# EAGLE design DRV8835 Breakout (EAGLE 7.5.0)
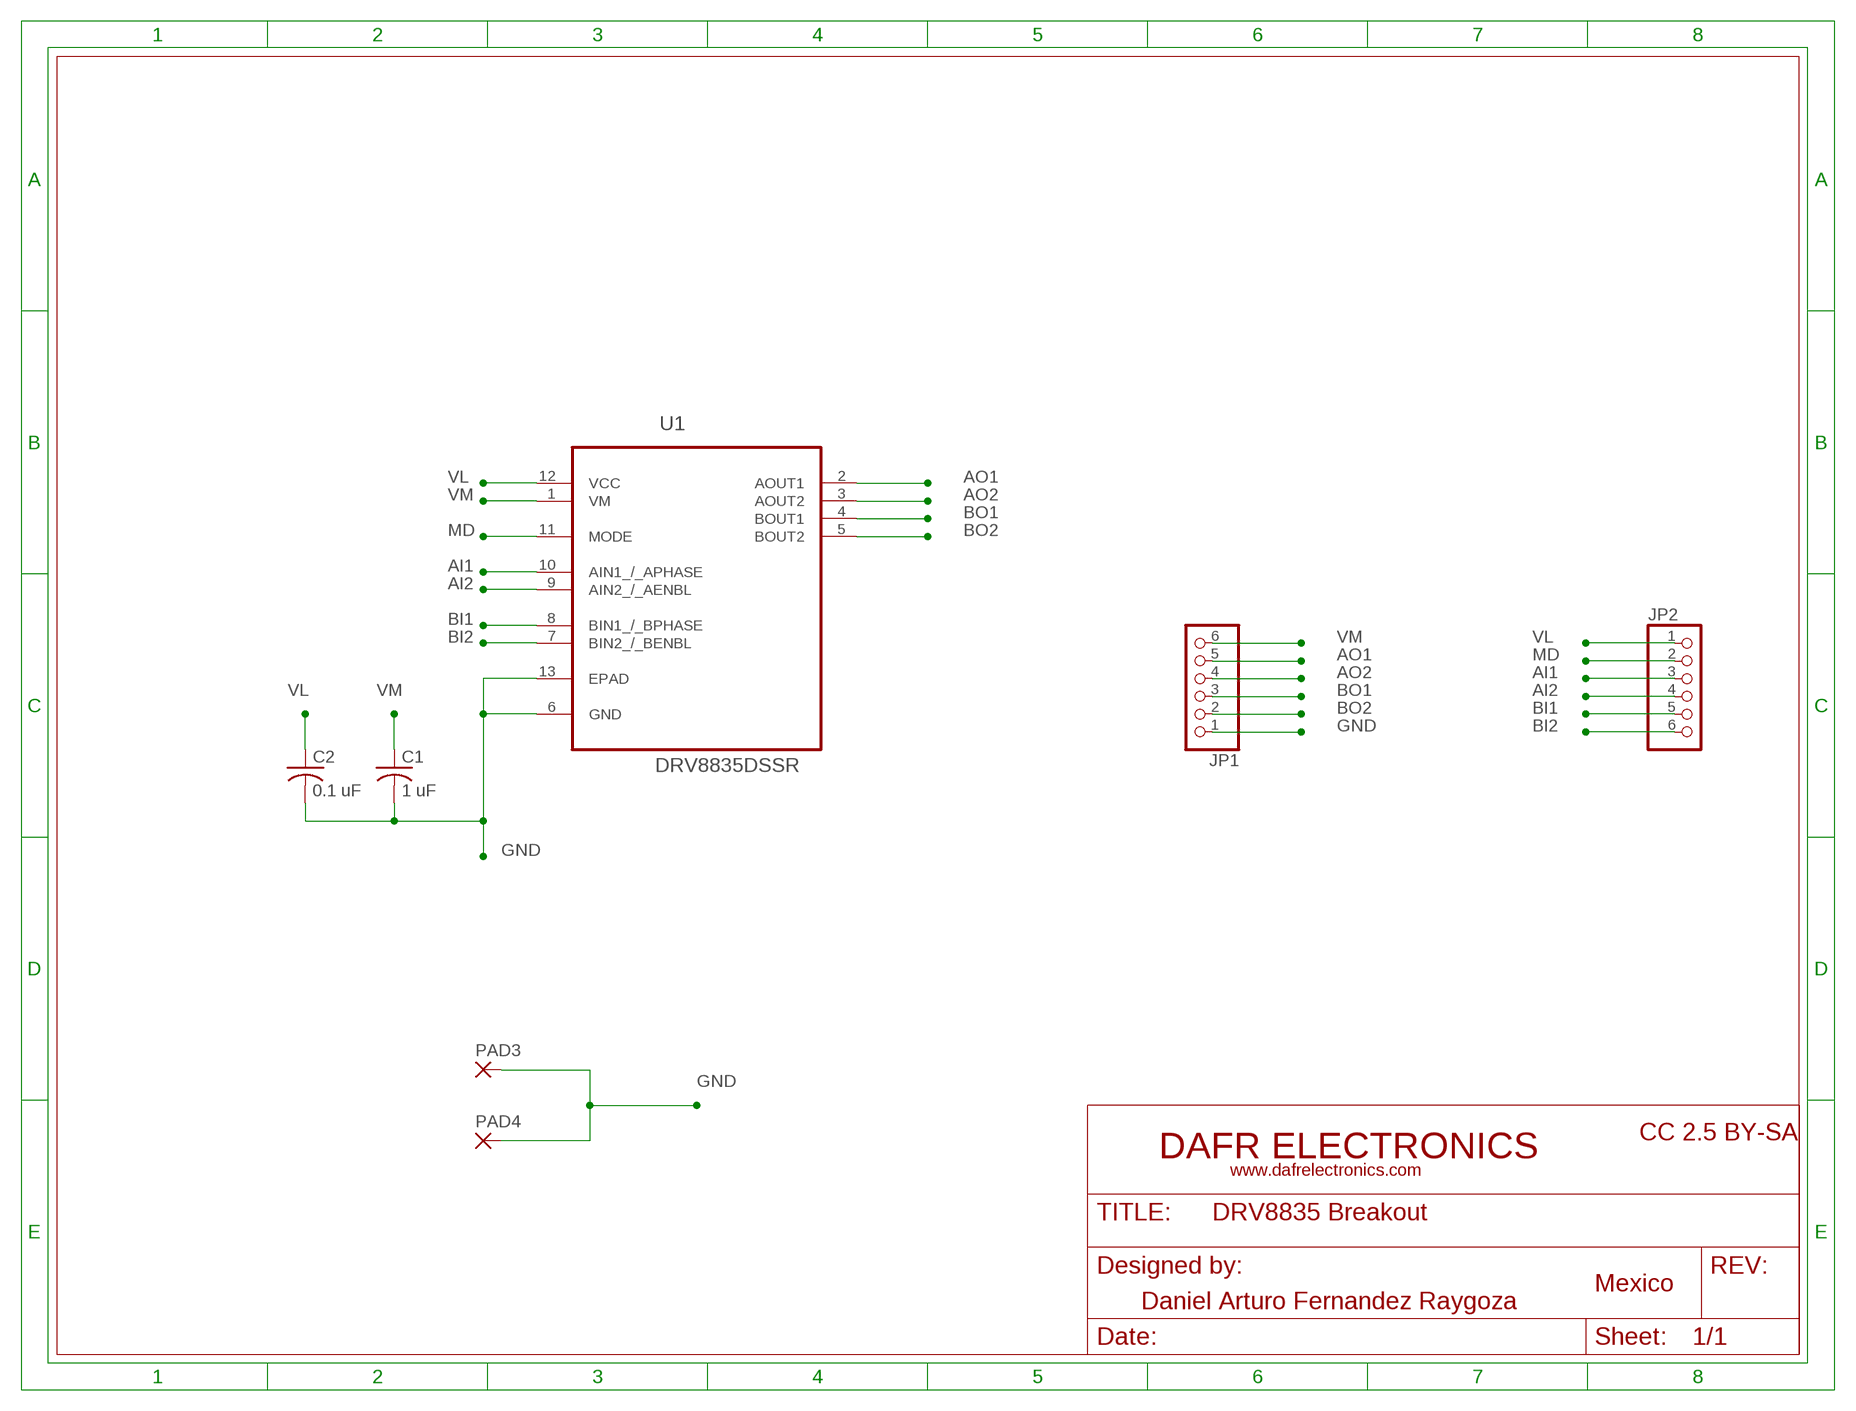
[diagram p0: schematic, sheet 1]

## Parts
C1  1 uF  C-USC0603K  [C0603K]
C2  0.1 uF  C-USC0603K  [C0603K]
JP1  PINHD-1X6CLEAN  [1X06-CLEAN]
JP2  PINHD-1X6CLEAN  [1X06-CLEAN]
PAD3  SMD2  [SMD1,27-2,54]
PAD4  SMD2  [SMD1,27-2,54]
U1  DRV8835DSSR  [SON50P200X300X80-13N]

## Nets
AI1: JP2.3 U1.10(AIN1_/_APHASE)
AI2: JP2.4 U1.9(AIN2_/_AENBL)
AO1: JP1.5 U1.2(AOUT1)
AO2: JP1.4 U1.3(AOUT2)
BI1: JP2.5 U1.8(BIN1_/_BPHASE)
BI2: JP2.6 U1.7(BIN2_/_BENBL)
BO1: JP1.3 U1.4(BOUT1)
BO2: JP1.2 U1.5(BOUT2)
GND: C1.2 C2.2 JP1.1 PAD3.1(P) PAD4.1(P) U1.6(GND) U1.13(EPAD)
MD: JP2.2 U1.11(MODE)
VL: C2.1 JP2.1 U1.12(VCC)
VM: C1.1 JP1.6 U1.1(VM)

## Library data of the parts
C1 C2 = adafruit:C-US: CAPACITOR, American symbol
JP1 JP2 = adafruit:PINHD-1X6: PIN HEADER
PAD3 PAD4 = wirepad:SMD2: SMD PAD
U1 = DRV8835:DRV8835DSSR: DUAL LOW VOLTAGE H-BRIDGE IC,SON-12; MPN: DRV8835DSSR; OC_FARNELL: 2115235; OC_NEWARK: 94T6065; PACKAGE: SON-12; SUPPLIER: TEXAS INSTRUMENTS

## Board
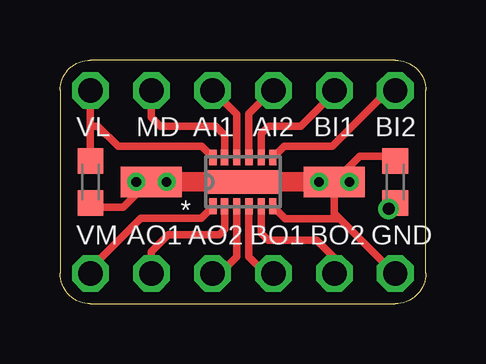
[diagram p1: board, top side]
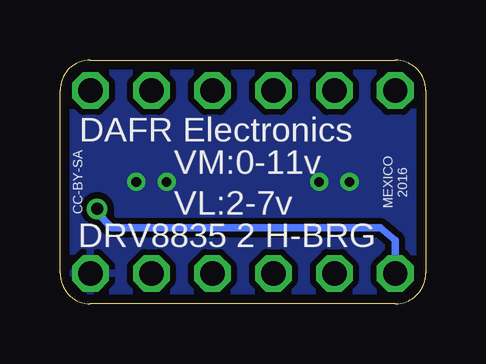
[diagram p2: board, bottom side, seen from below]

Size 15.24 x 10.16 mm. Coordinates in mm from the lower left corner, seen from the top.
Outline: 1.27,0 13.97,0 arc90 15.24,1.27 15.24,8.89 arc90 13.97,10.16 1.27,10.16 arc90 0,8.89 0,1.27 arc90 1.27,0
Copper layers (1*16): Top 0.0356mm / dielectric 1.5011mm / Bottom 0.0356mm
Design rules "oshpark-2layer *": minimum track width 6mil, minimum drill 13mil, track to track 6mil, track to pad 6mil, pad to pad 6mil, via to via 6mil, smd to smd 6mil, copper to edge 15mil, drill to drill 6mil, minimum pad ring 7mil, minimum via ring 7mil, stop-mask expansion 2.5mil, vias tented up to drill 25mil, thermal gap 10mil

### Footprints (pad centres in the part's own frame; a part is rotated, then mirrored left to right if it is on the bottom)
C0603K = smd 1.05 x 1.08: 1 -0.875,0; 2 0.875,0
1X06-CLEAN = drill 1.016 octagon: 1 -6.35,0; 2 -3.81,0; 3 -1.27,0; 4 1.27,0; 5 3.81,0; 6 6.35,0
SMD1,27-2,54 = smd 1.27 x 2.54: 1 0,0
SON50P200X300X80-13N = smd 0.66 x 0.305: 1 -1.016,1.245; 2 -1.016,0.762; 3 -1.016,0.254; 4 -1.016,-0.254; 5 -1.016,-0.762; 6 -1.016,-1.245; 7 1.016,-1.245; 8 1.016,-0.762; 9 1.016,-0.254; 10 1.016,0.254; 11 1.016,0.762; 12 1.016,1.245 | smd 0.991 x 3.099: 13 0,0

### Placement (x,y rotation side)
C1  13.97,5.08 90 top
C2  1.27,5.08 270 top
JP1  7.62,1.27 180 top
JP2  7.62,8.89 0 top
PAD3  11.43,5.08 90 top
PAD4  3.81,5.08 90 top
U1  7.62,5.08 90 top

### Tracks (layer width: path | path; a pad name or v marks a point on that pad's centre or on a via)
AI1
  Top 0.305: U1.10 7.37,7.9 6.37,8.89 JP2.3
AI2
  Top 0.305: U1.9 7.87,7.92 8.84,8.89 JP2.4
AO1
  Top 0.305: U1.2 6.86,3.1 6.63,2.87 4.51,2.87 3.81,2.17 JP1.5
AO2
  Top 0.305: U1.3 7.37,1.97 6.66,1.27 JP1.4
BI1
  Top 0.305: U1.8 8.38,7.09 8.7,7.4 10.03,7.4 11.43,8.8 JP2.5
BI2
  Top 0.305: U1.7 9.34,6.57 11.35,6.57 13.67,8.89 JP2.6
BO1
  Top 0.305: U1.4 7.87,1.97 8.57,1.27 JP1.3
BO2
  Top 0.305: U1.5 8.38,2.95 8.67,2.66 10.7,2.66 11.43,1.93 JP1.2
GND  (via drill 0.4)
  Top 0.305: U1.6 9.39,3.54 11.66,3.54 | 11.66,3.54 13.93,1.27 JP1.1 | 11.66,3.54 11.43,3.77 PAD3.1 11.43,5.1 12.49,6.16 13.77,6.16 C1.2 | C2.2 1.46,4.02 2.63,4.02 3.69,5.08 PAD4.1
  Top 0.813: PAD4.1 v4.45,5.08 U1.13 v10.79,5.08 PAD3.1
  other vias: 3.17,5.08 12.06,5.08
  pour Bottom (isolate 0.254): 0,10.16 0,0 15.24,0 15.24,10.16
MD
  Top 0.305: U1.11 6.86,7.03 6.49,7.4 4.18,7.4 3.81,7.77 JP2.2
VL
  Top 0.305: JP2.1 1.27,7.41 | 1.27,7.41 C2.1 | U1.12 5.9,6.57 2.42,6.57 1.58,7.41 1.27,7.41
VM  (via drill 0.5)
  Top 0.305: U1.1 5.88,3.57 3.37,3.57 1.27,1.47 JP1.6 | 13.57,3.81 C1.1 v13.69,3.96
  Bottom 0.305: JP1.6 1.27,2.65 1.91,3.17 12.06,3.17 12.07,3.18 13.08,3.18 13.69,3.79 v13.69,3.96

### Text on the board
tNames: VL | MD | AI1 | AI2 | BI1 | BI2 | * | VM | AO1 | AO2 | BO1 | BO2 | GND
bNames: DAFR Electronics | MEXICO / 2016 | VM:0-11v | CC-BY-SA | VL:2-7v | DRV8835 2 H-BRG